# EasyEDA schematic FYP_DevBoard.json
TITLE: Sheet_1; REV: 1.0; Date: 2025-08-17; Sheet: 1/1; Drawn By: gerritcbuter; Company: Your Company
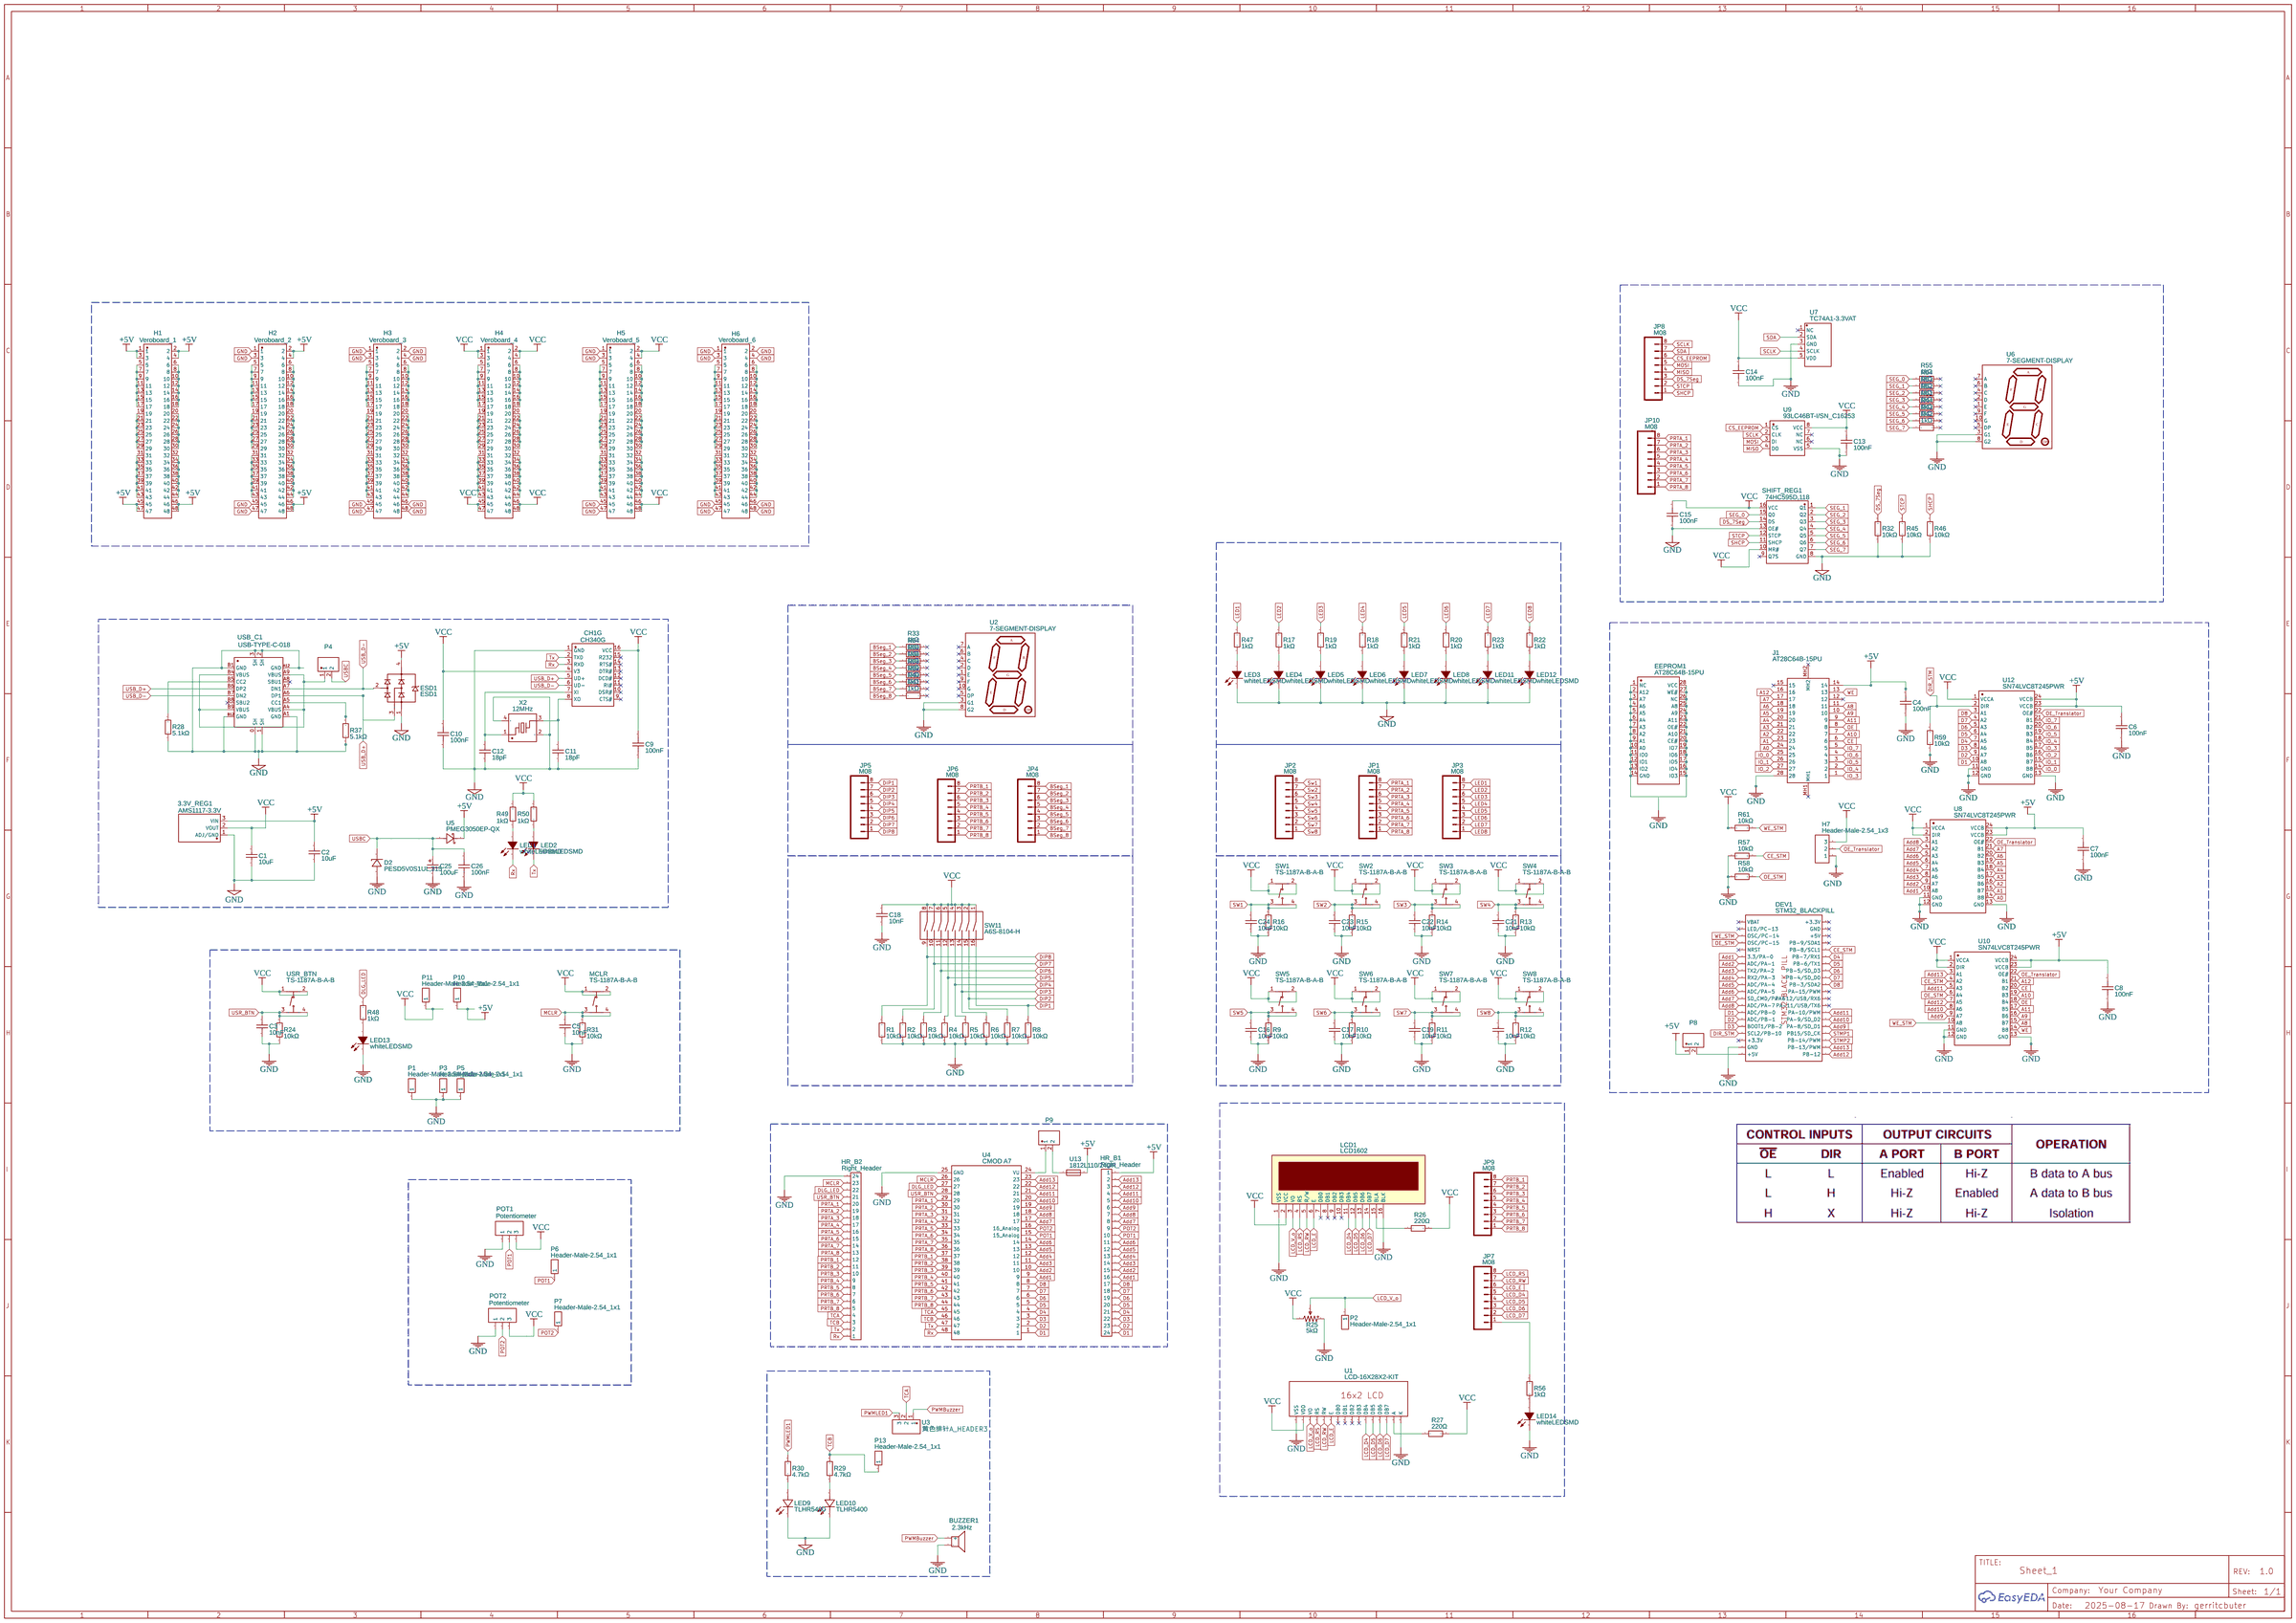
[diagram p0: schematic sheet]

## Parts
3.3V_REG1  AMS1117-3.3V  [SOT-89-3_L4.5-W2.5-P1.50-LS4.2-BR]
BUZZER1  2.3kHz  [BUZ-TH_BD12.0-P7.60-D0.6-FD]
C1  10uF  [C0603]
C2  10uF  [C0603]
C3  10nF  [C0603]
C4  100nF  [C0603]
C5  10nF  [C0603]
C6  100nF  [C0603]
C7  100nF  [C0603]
C8  100nF  [C0603]
C9  100nF  [C0603]
C10  100nF  [C0603]
C11  18pF  [C0603]
C12  18pF  [C0603]
C13  100nF  [C0603]
C14  100nF  [C0603]
C15  100nF  [C0603]
C16  10nF  [C0603]
C17  10nF  [C0603]
C18  10nF  [C0603]
C19  10nF  [C0603]
C20  10nF  [C0603]
C21  10nF  [C0603]
C22  10nF  [C0603]
C23  10nF  [C0603]
C24  10nF  [C0603]
C25  100uF  [CASE-B_3528]
C26  100nF  [C0603]
CH1G  CH340G  [SOIC-16_L9.9-W3.9-P1.27-LS6.0-BL]
D2  PESD5V0S1UL,315  [SOD-882_L1.0-W0.6-RD]
DEV1  STM32_BLACKPILL  [STM32_BLACKPILL]
EEPROM1  AT28C64B-15PU  [DIP-28_L37.0-W13.8-P2.54-LS15.8-BL]
ESD1  ESD1  [SOT-143_L2.9-W1.3-P1.92-LS2.3-BR]
H1  Veroboard_1  [VEROBOARD_HEADER]
H2  Veroboard_2  [VEROBOARD_HEADER]
H3  Veroboard_3  [VEROBOARD_HEADER]
H4  Veroboard_4  [VEROBOARD_HEADER]
H5  Veroboard_5  [VEROBOARD_HEADER]
H6  Veroboard_6  [VEROBOARD_HEADER]
H7  Header-Male-2.54_1x3  [HDR-TH_3P-P2.54-V-M-1]
HR_B1  Right_Header  [HEADER_FEMALE_2.54_1X24]
HR_B2  Right_Header  [HEADER_FEMALE_2.54_1X24]
J1  AT28C64B-15PU  [28655410]
JP1  M08  [1X08_NO_SILK]
JP2  M08  [1X08_NO_SILK]
JP3  M08  [1X08_NO_SILK]
JP4  M08  [1X08_NO_SILK]
JP5  M08  [1X08_NO_SILK]
JP6  M08  [1X08_NO_SILK]
JP7  M08  [1X08_NO_SILK]
JP8  M08  [1X08_NO_SILK]
JP9  M08  [1X08_NO_SILK]
JP10  M08  [1X08_NO_SILK]
LCD1  LCD1602  [LCD1602]
LED1  whiteLEDSMD  [LED0805-R-RD]
LED2  whiteLEDSMD  [LED0805-R-RD]
LED3  whiteLEDSMD  [LED0805-R-RD]
LED4  whiteLEDSMD  [LED0805-R-RD]
LED5  whiteLEDSMD  [LED0805-R-RD]
LED6  whiteLEDSMD  [LED0805-R-RD]
LED7  whiteLEDSMD  [LED0805-R-RD]
LED8  whiteLEDSMD  [LED0805-R-RD]
LED9  TLHR5400  [LED-TH_BD5.8-P2.54-RD]
LED10  TLHR5400  [LED-TH_BD5.8-P2.54-RD]
LED11  whiteLEDSMD  [LED0805-R-RD]
LED12  whiteLEDSMD  [LED0805-R-RD]
LED13  whiteLEDSMD  [LED0805-R-RD]
LED14  whiteLEDSMD  [LED0805-R-RD]
MCLR  TS-1187A-B-A-B  [SW-SMD_4P-L5.1-W5.1-P3.70-LS6.5-TL_H1.5]
P1  Header-Male-2.54_1x1  [HDR-TH_1P-P2.54-V-M]
P2  Header-Male-2.54_1x1  [HDR-TH_1P-P2.54-V-M]
P3  Header-Male-2.54_1x1  [HDR-TH_1P-P2.54-V-M]
P4  Female header1*2P  [HDR-TH_2P-P2.00-V-F-1]
P5  Header-Male-2.54_1x1  [HDR-TH_1P-P2.54-V-M]
P6  Header-Male-2.54_1x1  [HDR-TH_1P-P2.54-V-M]
P7  Header-Male-2.54_1x1  [HDR-TH_1P-P2.54-V-M]
P8  Female header1*2P  [HDR-TH_2P-P2.00-V-F-1]
P9  Female header1*2P  [HDR-TH_2P-P2.00-V-F-1]
P10  Header-Male-2.54_1x1  [HDR-TH_1P-P2.54-V-M]
P11  Header-Male-2.54_1x1  [HDR-TH_1P-P2.54-V-M]
P13  Header-Male-2.54_1x1  [HDR-TH_1P-P2.54-V-M]
POT1  Potentiometer  [SW-TH_PTV09A-4015F-B502]
POT2  Potentiometer  [SW-TH_PTV09A-4015F-B502]
R1  10kΩ  [R0603]
R2  10kΩ  [R0603]
R3  10kΩ  [R0603]
R4  10kΩ  [R0603]
R5  10kΩ  [R0603]
R6  10kΩ  [R0603]
R7  10kΩ  [R0603]
R8  10kΩ  [R0603]
R9  10kΩ  [R0603]
R10  10kΩ  [R0603]
R11  10kΩ  [R0603]
R12  10kΩ  [R0603]
R13  10kΩ  [R0603]
R14  10kΩ  [R0603]
R15  10kΩ  [R0603]
R16  10kΩ  [R0603]
R17  1kΩ  [R0402]
R18  1kΩ  [R0402]
R19  1kΩ  [R0402]
R20  1kΩ  [R0402]
R21  1kΩ  [R0402]
R22  1kΩ  [R0402]
R23  1kΩ  [R0402]
R24  10kΩ  [R0603]
R25  5kΩ  [RES-ADJ-TH_L9.5-W4.8-P2.54_3296Y]
R26  220Ω  [R0603]
R27  220Ω  [R0603]
R28  5.1kΩ  [R0603]
R29  4.7kΩ  [R0402]
R30  4.7kΩ  [R0402]
R31  10kΩ  [R0603]
R32  10kΩ  [R0603]
R33  1kΩ  [R0603]
R34  1kΩ  [R0603]
R35  1kΩ  [R0603]
R36  1kΩ  [R0603]
R37  5.1kΩ  [R0603]
R38  1kΩ  [R0603]
R39  1kΩ  [R0603]
R40  1kΩ  [R0603]
R41  1kΩ  [R0603]
R42  1kΩ  [R0603]
R43  1kΩ  [R0603]
R44  1kΩ  [R0603]
R45  10kΩ  [R0603]
R46  10kΩ  [R0603]
R47  1kΩ  [R0402]
R48  1kΩ  [R0603]
R49  1kΩ  [R0603]
R50  1kΩ  [R0603]
R51  1kΩ  [R0603]
R52  1kΩ  [R0603]
R53  1kΩ  [R0603]
R54  1kΩ  [R0603]
R55  1kΩ  [R0603]
R56  1kΩ  [R0603]
R57  10kΩ  [R0603]
R58  10kΩ  [R0603]
R59  10kΩ  [R0603]
R61  10kΩ  [R0603]
SHIFT_REG1  74HC595D,118  [SOIC-16_L9.9-W3.9-P1.27-LS6.0-BL]
SW1  TS-1187A-B-A-B  [SW-SMD_4P-L5.1-W5.1-P3.70-LS6.5-TL_H1.5]
SW2  TS-1187A-B-A-B  [SW-SMD_4P-L5.1-W5.1-P3.70-LS6.5-TL_H1.5]
SW3  TS-1187A-B-A-B  [SW-SMD_4P-L5.1-W5.1-P3.70-LS6.5-TL_H1.5]
SW4  TS-1187A-B-A-B  [SW-SMD_4P-L5.1-W5.1-P3.70-LS6.5-TL_H1.5]
SW5  TS-1187A-B-A-B  [SW-SMD_4P-L5.1-W5.1-P3.70-LS6.5-TL_H1.5]
SW6  TS-1187A-B-A-B  [SW-SMD_4P-L5.1-W5.1-P3.70-LS6.5-TL_H1.5]
SW7  TS-1187A-B-A-B  [SW-SMD_4P-L5.1-W5.1-P3.70-LS6.5-TL_H1.5]
SW8  TS-1187A-B-A-B  [SW-SMD_4P-L5.1-W5.1-P3.70-LS6.5-TL_H1.5]
SW11  A6S-8104-H  [SW-SMD_16P-L21.3-W6.2-P2.54-LS9.8]
U1  LCD-16X28X2-KIT  [LCD-8X2-KIT]
U2  7-SEGMENT-DISPLAY  [7-SEGMENT-DISPLAY]
U3  黄色排针A_HEADER3  [HDR-TH_3P-P2.54-V-M-1]
U4  CMOD A7  [DIGILENT CMOD A7-35T]
U5  PMEG3050EP-QX  [SOD-128_L3.7-W2.5-LS4.7-RD]
U6  7-SEGMENT-DISPLAY  [7-SEGMENT-DISPLAY]
U7  TC74A1-3.3VAT  [TO-220-5L_L10.2-W4.5-P1.71-L]
U8  SN74LVC8T245PWR  [TSSOP-24_L7.8-W4.4-P0.65-LS6.4-BL]
U9  93LC46BT-I/SN_C16253  [SOIC-8_L4.9-W3.9-P1.27-LS6.0-BL]
U10  SN74LVC8T245PWR  [TSSOP-24_L7.8-W4.4-P0.65-LS6.4-BL]
U12  SN74LVC8T245PWR  [TSSOP-24_L7.8-W4.4-P0.65-LS6.4-BL]
U13  1812L110/24DR  [R1812]
USB_C1  USB-TYPE-C-018  [USB-C_SMD-TYPE-C-31-M-12]
USR_BTN  TS-1187A-B-A-B  [SW-SMD_4P-L5.1-W5.1-P3.70-LS6.5-TL_H1.5]
X2  12MHz  [CRYSTAL-SMD_4P-L3.2-W2.5-BL]

## Library data of the parts
3.3V_REG1 = AMS1117-3.3V_C5120796: Supplier: LCSC; Supplier Part: C5120796; Manufacturer: MSKSEMI(美森科); Contributor: lcsc; JLCPCB Part Class: Extended Part
BUZZER1 = TMB12A05: Supplier: LCSC; Manufacturer: 华能; Supplier Part: C96093; JLCPCB Part Class: Extended Part
C1 C2 = CL10A105KB8NNNC: Supplier: LCSC; Manufacturer: SAMSUNG(三星); Supplier Part: C15849; JLCPCB Part Class: Basic Part
C3 C5 C16-C24 = 0603B103K500NT: Supplier: LCSC; Manufacturer: FH(风华); Supplier Part: C57112; JLCPCB Part Class: Basic Part
C4 C6-C10 C13-C15 C26 = CC0603KRX7R9BB104: Supplier: LCSC; Manufacturer: YAGEO(国巨); Supplier Part: C14663; JLCPCB Part Class: Basic Part
C11 C12 = CL10C180JB8NNNC: Supplier: LCSC; Manufacturer: SAMSUNG(三星); Supplier Part: C1647; JLCPCB Part Class: Basic Part
C25 = TAJB107K006RNJ: Supplier: LCSC; Manufacturer: Kyocera AVX; Supplier Part: C16133; JLCPCB Part Class: Basic Part
CH1G = CH340G: Supplier: LCSC; Manufacturer: WCH(南京沁恒); Supplier Part: C14267; JLCPCB Part Class: Extended Part
D2 = PESD5V0S1UL,315: Contributor: LCSC; Supplier Part: C85402; Supplier: LCSC; Manufacturer: Nexperia(安世); JLCPCB Part Class: Extended Part
DEV1 = STM32_BLACKPILL: Contributor: Matty87
EEPROM1 = AT28C64B-15PU: Supplier: LCSC; Manufacturer: MICROCHIP(美国微芯); Supplier Part: C41982; JLCPCB Part Class: Extended Part
ESD1 = TPPRTR5V0U2X: Supplier: LCSC; Supplier Part: C558444; Manufacturer: TECH PUBLIC(台舟); Contributor: LCSC; JLCPCB Part Class: Extended Part
H1-H6 = X5521FV-2X24-C70D30-1000: Contributor: LCSC; Supplier: LCSC; Supplier Part: C2682211; Manufacturer: XKB Connectivity(中国星坤); JLCPCB Part Class: Extended Part
H7 = Header-Male-2.54_1x3: Supplier: LCSC; Manufacturer: BOOMELE(博穆精密); Manufacturer Part: 2.54-1*3P针; Supplier Part: C49257; JLCPCB Part Class: Extended Part
HR_B1 HR_B2 = Header_Female_2.54_1x24: Contributor: benjaminbiles01
J1 = 28-6554-10: Contributor: Noah Tomkins (McNoahTomkins)
JP1-JP10 = M08: Contributor: SparkFun
LCD1 = LCD1602: Manufacturer: LONTECH(厦门龙特); Manufacturer Part: LCM1602K-NSW-BBW; Supplier Part: C83275; Supplier: LCSC; Contributor: LCEDA_Lib
LED1-LED8 LED11-LED14 = whiteLEDSMD: Supplier: LCSC; Manufacturer: KENTO; Manufacturer Part: KT-0805W; Supplier Part: C34499; JLCPCB Part Class: Basic Part
LED9 LED10 = TLHR5400: Supplier: LCSC; Supplier Part: C3013853; Manufacturer: VISHAY(威世); Contributor: lcsc; JLCPCB Part Class: Extended Part
MCLR SW1-SW8 USR_BTN = TS-1187A-B-A-B: Contributor: LCSC; Supplier: LCSC; Supplier Part: C318884; Manufacturer: XKB Connection(中国星坤); JLCPCB Part Class: Basic Part
P1-P3 P5-P7 P10 P11 P13 = Header-Male-2.54_1x1: Supplier: LCSC; Manufacturer: BOOMELE(博穆精密); Supplier Part: C81276; JLCPCB Part Class: Extended Part
P4 P8 P9 = Female header1*2P: Supplier: LCSC; Manufacturer: BOOMELE(博穆精密); Manufacturer Part: 2.0-1*2P母; Supplier Part: C66509; JLCPCB Part Class: Extended Part
POT1 POT2 = Header-Male-2.54_1x3: JLCPCB Part Class: Extended Part; Package Display: No
R1-R16 R24 R31 R32 R45 R46 R57-R59 R61 = 0603WAF1002T5E: Supplier: LCSC; Manufacturer: UNI-ROYAL(厚声); Supplier Part: C25804; JLCPCB Part Class: Basic Part
R17-R23 R47 = 0402WGF1001TCE: Supplier: LCSC; Manufacturer: UNI-ROYAL(厚声); Supplier Part: C11702; JLCPCB Part Class: Basic Part
R25 = 3296Y-1-502LF: Contributor: lcsc; Supplier: LCSC; Supplier Part: C780116; Manufacturer: BOURNS; JLCPCB Part Class: Extended Part
R26 R27 = 0603WAF2200T5E: Supplier: LCSC; Manufacturer: UNI-ROYAL(厚声); Supplier Part: C22962; JLCPCB Part Class: Basic Part
R28 R37 = 0603WAF5101T5E: Supplier: LCSC; Manufacturer: UNI-ROYAL(厚声); Supplier Part: C23186; JLCPCB Part Class: Basic Part
R29 R30 = 0402WGF4701TCE: Supplier: LCSC; Manufacturer: UNI-ROYAL(厚声); Supplier Part: C25900; JLCPCB Part Class: Basic Part
R33-R36 R38-R44 R48-R56 = 0603WAF1001T5E: Supplier: LCSC; Manufacturer: UNI-ROYAL(厚声); Supplier Part: C21190; JLCPCB Part Class: Basic Part
SHIFT_REG1 = 74HC595D,118: Supplier: LCSC; Manufacturer: Nexperia(安世); Supplier Part: C5947; JLCPCB Part Class: Basic Part
SW11 = A6S-8104-H: Contributor: LCSC; Supplier: LCSC; Supplier Part: C231310; Manufacturer: OMRON(欧姆龙); JLCPCB Part Class: Extended Part
U1 = LCD-16X28X2-KIT: Standard text-only 16x2 parallel input LCD; Contributor: SparkFun
U2 U6 = 7-SEGMENT-DISPLAY: Contributor: SparkFun
U3 = 黄色排针A_HEADER3: Contributor: lcsc; Supplier: LCSC; Supplier Part: C9900019266; Manufacturer: null; JLCPCB Part Class: Extended Part
U4 = CMOD A7: Manufacturer: Digilent Inc.; Manufacturer Part: 410-328-35; Supplier: Digi-Key; Supplier Part: 1286-1130-ND; link: https://reference.digilentinc.com/reference/programmable-logic/cmod-a7/start; Contributor: 0johnkim
U5 = PMEG3050EP-QX: Supplier: LCSC; Supplier Part: C5311573; Manufacturer: Nexperia(安世); JLCPCB Part Class: Extended Part; Contributor: lcsc
U7 = TC74A1-3.3VAT: Contributor: lcsc; Supplier: LCSC; Supplier Part: C641444; Manufacturer: MICROCHIP(美国微芯); JLCPCB Part Class: Extended Part
U8 U10 U12 = SN74LVC8T245PWR: Supplier: LCSC; Manufacturer: TI(德州仪器); Supplier Part: C27643; JLCPCB Part Class: Extended Part
U9 = 93LC46BT-I/SN_C16253: Supplier: LCSC; Manufacturer: MICROCHIP(美国微芯); Manufacturer Part: 93LC46BT-I/SN; Supplier Part: C16253; JLCPCB Part Class: Extended Part
U13 = 1812L110/24DR: Contributor: LCSC; Supplier: LCSC; Supplier Part: C207066; Manufacturer: Littelfuse(美国力特); JLCPCB Part Class: Extended Part
USB_C1 = USB-TYPE-C-018: Supplier: LCSC; Supplier Part: C2927038; Manufacturer: DEALON(德艺隆); Contributor: LCSC; JLCPCB Part Class: Extended Part
X2 = 7B012000Q01: Contributor: LCSC; Supplier: LCSC; Supplier Part: C654951; Manufacturer: HD(浩都频率); JLCPCB Part Class: Extended Part

## Nets
+5V: 3.3V_REG1.3(VIN) C2.2 C4.2 C6.2 C7.2 C8.2 ESD1.4 H1.1 H1.2 H1.3 H1.4 H1.45 H1.46 H1.47 H1.48 H2.2 H2.4 H2.46 H2.48 HR_B1.1 J1.14 P8.1 P10.1 U5.1(K) U8.23(VCCB) U8.24(VCCB) U10.23(VCCB) U10.24(VCCB) U12.23(VCCB) U12.24(VCCB) U13.2
GND: 3.3V_REG1.1(ADJ/GND) BUZZER1.2 C1.1 C2.1 C3.1 C4.1 C5.1 C6.1 C7.1 C8.1 C9.1 C10.1 C11.1 C12.1 C13.1 C14.1 C15.1 C16.1 C17.1 C18.1 C19.1 C20.1 C21.1 C22.1 C23.1 C24.1 C25.2 C26.1 CH1G.1(GND) D2.2(A) DEV1.39(GND) ESD1.1 H2.1 H2.3 H2.45 H2.47 H3.1 H3.2 H3.3 H3.4 H3.45 H3.46 H3.47 H3.48 H5.1 H5.3 H5.45 H5.47 H6.1 H6.2 H6.3 H6.4 H6.45 H6.46 H6.47 H6.48 H7.1 HR_B2.24 J1.28 LCD1.1(VSS) LCD1.16(BLK) LED3.2(K) LED4.2(K) LED5.2(K) LED6.2(K) LED7.2(K) LED8.2(K) LED9.1(K) LED10.1(K) LED11.2(K) LED12.2(K) LED13.2(K) LED14.2(K) P1.1 P3.1 P5.1 POT1.1 POT2.1 R1.1 R2.1 R3.1 R4.1 R5.1 R6.1 R7.1 R8.1 R9.1 R10.1 R11.1 R12.1 R13.1 R14.1 R15.1 R16.1 R24.1 R25.1 R28.1 R31.1 R32.1 R37.1 R45.1 R46.1 R57.1 R58.1 R59.1 SHIFT_REG1.8(GND) SHIFT_REG1.13(OE#) U1.1(VSS) U1.16(K) U2.3(G1) U2.8(G2) U4.25(GND) U6.3(G1) U6.8(G2) U7.3(GND) U8.11(GND) U8.12(GND) U8.13(GND) U9.5(VSS) U10.11(GND) U10.12(GND) U10.13(GND) U12.11(GND) U12.12(GND) U12.13(GND) USB_C1.0(SH) USB_C1.1(SH) USB_C1.2(SH) USB_C1.3(SH) USB_C1.A1(GND) USB_C1.A12(GND) USB_C1.B1(GND) USB_C1.B12(GND) X2.2(GND) X2.4(GND)
VCC: 3.3V_REG1.2(VOUT) C1.2 C9.2 C10.2 C13.2 C14.2 C15.2 C18.2 CH1G.4(V3) CH1G.16(VCC) H4.1 H4.2 H4.3 H4.4 H4.45 H4.46 H4.47 H4.48 H5.2 H5.4 H5.46 H5.48 H7.3 LCD1.2(VCC) MCLR.1(A) MCLR.2(B) P11.1 POT1.3 POT2.3 R25.3 R26.2 R27.2 R49.2 R50.2 R61.1 SHIFT_REG1.10(MR#) SHIFT_REG1.16(VCC) SW1.1(A) SW1.2(B) SW2.1(A) SW2.2(B) SW3.1(A) SW3.2(B) SW4.1(A) SW4.2(B) SW5.1(A) SW5.2(B) SW6.1(A) SW6.2(B) SW7.1(A) SW7.2(B) SW8.1(A) SW8.2(B) SW11.1 SW11.2 SW11.3 SW11.4 SW11.5 SW11.6 SW11.7 SW11.8 U1.2(VDD) U7.5(VDD) U8.1(VCCA) U8.2(DIR) U9.8(VCC) U10.1(VCCA) U10.2(DIR) U12.1(VCCA) USR_BTN.1(A) USR_BTN.2(B)
A0: J1.24 U8.14(B8)
A1: J1.23 U8.15(B7)
A2: J1.22 U8.16(B6)
A3: J1.21 U8.17(B5)
A4: J1.20 U8.18(B4)
A5: J1.19 U8.19(B3)
A6: J1.18 U8.20(B2)
A7: J1.17 U8.21(B1)
A8: J1.11 U10.15(B7)
A9: J1.10 U10.16(B6)
A10: J1.7 U10.19(B3)
A11: J1.9 U10.17(B5)
A12: J1.16 U10.21(B1)
Add1: DEV1.26(3.3/PA-0) HR_B1.16 U4.9 U8.10(A8)
Add2: DEV1.27(ADC/PA-1) HR_B1.15 U4.10 U8.9(A7)
Add3: DEV1.28(TX2/PA-2) HR_B1.14 U4.11 U8.8(A6)
Add4: DEV1.29(RX2/PA-3) HR_B1.13 U4.12 U8.7(A5)
Add5: DEV1.30(ADC/PA-4) HR_B1.12 U4.13 U8.6(A4)
Add6: DEV1.31(ADC/PA-5) HR_B1.11 U4.14 U8.5(A3)
Add7: DEV1.32(SD_CMD/PA-6) HR_B1.8 U4.17 U8.4(A2)
Add8: DEV1.33(ADC/PA-7) HR_B1.7 U4.18 U8.3(A1)
Add9: DEV1.5(PA-8/SD_D1) HR_B1.6 U4.19 U10.9(A7)
Add10: DEV1.6(PA-9/SD_D2) HR_B1.5 U4.20 U10.8(A6)
Add11: DEV1.7(PA-10/PWM) HR_B1.4 U4.21 U10.5(A3)
Add12: DEV1.1(PB-12) HR_B1.3 U4.22 U10.7(A5)
Add13: DEV1.2(PB-13/PWM) HR_B1.2 U4.23 U10.3(A1)
BSeg_1: JP4.8 R33.1
BSeg_2: JP4.7 R34.1
BSeg_3: JP4.6 R35.1
BSeg_4: JP4.5 R36.1
BSeg_5: JP4.4 R38.1
BSeg_6: JP4.3 R39.1
BSeg_7: JP4.2 R40.1
BSeg_8: JP4.1 R41.1
CE: J1.6 U10.20(B2)
CE_STM: DEV1.16(PB-8/SCL1) R57.2 U10.4(A2)
CS_EEPROM: JP8.6 U9.1(CS)
D1: DEV1.34(ADC/PB-0) HR_B1.24 U4.1 U12.10(A8)
D2: DEV1.35(ADC/PB-1) HR_B1.23 U4.2 U12.9(A7)
D3: DEV1.36(BOOT1/PB-2) HR_B1.22 U4.3 U12.8(A6)
D4: DEV1.15(PB-7/RX1) HR_B1.21 U4.4 U12.7(A5)
D5: DEV1.14(PB-6/TX1) HR_B1.20 U4.5 U12.6(A4)
D6: DEV1.13(PB-5/SD_D3) HR_B1.19 U4.6 U12.5(A3)
D7: DEV1.12(PB-4/SD_D0) HR_B1.18 U4.7 U12.4(A2)
D8: DEV1.11(PB-3/SDA2) HR_B1.17 U4.8 U12.3(A1)
DIP1: JP5.8 R8.2 SW11.16
DIP2: JP5.7 R7.2 SW11.15
DIP3: JP5.6 R6.2 SW11.14
DIP4: JP5.5 R5.2 SW11.13
DIP5: JP5.4 R4.2 SW11.12
DIP6: JP5.3 R3.2 SW11.11
DIP7: JP5.2 R2.2 SW11.10
DIP8: JP5.1 R1.2 SW11.9
DIR_STM: DEV1.37(SCL2/PB-10) R59.2 U12.2(DIR)
DLG_LED: HR_B2.22 R48.1 U4.27
DS_7Seg: JP8.3 R32.2 SHIFT_REG1.14(DS)
IO_0: J1.25 U12.14(B8)
IO_1: J1.26 U12.15(B7)
IO_2: J1.27 U12.16(B6)
IO_3: J1.1 U12.17(B5)
IO_4: J1.2 U12.18(B4)
IO_5: J1.3 U12.19(B3)
IO_6: J1.4 U12.20(B2)
IO_7: J1.5 U12.21(B1)
LCD_D4: JP7.5 LCD1.11(DB4) U1.11(DB4)
LCD_D5: JP7.4 LCD1.12(DB5) U1.12(DB5)
LCD_D6: JP7.3 LCD1.13(DB6) U1.13(DB6)
LCD_D7: JP7.2 LCD1.14(DB7) U1.14(DB7)
LCD_E: JP7.6 LCD1.6(E) U1.6(E)
LCD_RS: JP7.8 LCD1.4(RS) U1.4(RS)
LCD_RW: JP7.7 LCD1.5(R/W) U1.5(RW)
LCD_V_o: LCD1.3(VO) P2.1 R25.2 U1.3(VO)
LED1: JP3.8 R47.2
LED2: JP3.7 R17.2
LED3: JP3.6 R19.2
LED4: JP3.5 R18.2
LED5: JP3.4 R21.2
LED6: JP3.3 R20.2
LED7: JP3.2 R23.2
LED8: JP3.1 R22.2
MCLR: C5.2 HR_B2.23 MCLR.3(C) MCLR.4(D) R31.2 U4.26
MISO: JP8.4 U9.4(DO)
MOSI: JP8.5 U9.3(DI)
OE: J1.8 U10.18(B4)
OE_STM: DEV1.24(OSC/PC-15) R58.2 U10.6(A4)
OE_Translator: H7.2 U8.22(OE#) U10.22(OE#) U12.22(OE#)
POT1: HR_B1.10 P6.1 POT1.2 U4.15(15 Analog)
POT2: HR_B1.9 P7.1 POT2.2 U4.16(16 Analog)
PRTA_1: HR_B2.20 JP1.8 JP10.8 U4.29
PRTA_2: HR_B2.19 JP1.7 JP10.7 U4.30
PRTA_3: HR_B2.18 JP1.6 JP10.6 U4.31
PRTA_4: HR_B2.17 JP1.5 JP10.5 U4.32
PRTA_5: HR_B2.16 JP1.4 JP10.4 U4.33
PRTA_6: HR_B2.15 JP1.3 JP10.3 U4.34
PRTA_7: HR_B2.14 JP1.2 JP10.2 U4.35
PRTA_8: HR_B2.13 JP1.1 JP10.1 U4.36
PRTB_1: HR_B2.12 JP6.8 JP9.8 U4.37
PRTB_2: HR_B2.11 JP6.7 JP9.7 U4.38
PRTB_3: HR_B2.10 JP6.6 JP9.6 U4.39
PRTB_4: HR_B2.9 JP6.5 JP9.5 U4.40
PRTB_5: HR_B2.8 JP6.4 JP9.4 U4.41
PRTB_6: HR_B2.7 JP6.3 JP9.3 U4.42
PRTB_7: HR_B2.6 JP6.2 JP9.2 U4.43
PRTB_8: HR_B2.5 JP6.1 JP9.1 U4.44
PWMBuzzer: BUZZER1.1(+) U3.1
PWMLED1: R30.2 U3.3
Rx: CH1G.3(RXD) HR_B2.1 LED1.2(K) U4.48
SCLK: JP8.8 U7.4(SCLK) U9.2(CLK)
SDA: JP8.7 U7.2(SDA)
SEG_0: R55.1 SHIFT_REG1.15(Q0)
SEG_1: R54.1 SHIFT_REG1.1(Q1)
SEG_2: R53.1 SHIFT_REG1.2(Q2)
SEG_3: R52.1 SHIFT_REG1.3(Q3)
SEG_4: R51.1 SHIFT_REG1.4(Q4)
SEG_5: R44.1 SHIFT_REG1.5(Q5)
SEG_6: R43.1 SHIFT_REG1.6(Q6)
SEG_7: R42.1 SHIFT_REG1.7(Q7)
SHCP: JP8.1 R46.2 SHIFT_REG1.11(SHCP)
STCP: JP8.2 R45.2 SHIFT_REG1.12(STCP)
STMP1: DEV1.4(PB15/SD_CK)
STMP2: DEV1.3(PB-14/PWM)
Sw1: JP2.8
SW1: C24.2 R16.2 SW1.3(C) SW1.4(D)
Sw2: JP2.7
SW2: C23.2 R15.2 SW2.3(C) SW2.4(D)
Sw3: JP2.6
SW3: C22.2 R14.2 SW3.3(C) SW3.4(D)
Sw4: JP2.5
SW4: C21.2 R13.2 SW4.3(C) SW4.4(D)
Sw5: JP2.4
SW5: C16.2 R9.2 SW5.3(C) SW5.4(D)
Sw6: JP2.3
SW6: C17.2 R10.2 SW6.3(C) SW6.4(D)
Sw7: JP2.2
SW7: C19.2 R11.2 SW7.3(C) SW7.4(D)
Sw8: JP2.1
SW8: C20.2 R12.2 SW8.3(C) SW8.4(D)
TCA: HR_B2.4 U3.2 U4.45
TCB: HR_B2.3 P13.1 R29.2 U4.46
Tx: CH1G.2(TXD) HR_B2.2 LED2.2(K) U4.47
USB_D+: CH1G.5(UD+) ESD1.3 USB_C1.A6(DP1) USB_C1.B6(DP2)
USB_D-: CH1G.6(UD-) ESD1.2 USB_C1.A7(DN1) USB_C1.B7(DN2)
USBC: C25.1 C26.2 D2.1(C) P4.2 U5.2(A)
USR_BTN: C3.2 HR_B2.21 R24.2 U4.28 USR_BTN.3(C) USR_BTN.4(D)
WE: J1.13 U10.14(B8)
WE_STM: DEV1.23(OSC/PC-14) R61.2 U10.10(A8)
Net-(C11-2): C11.2 CH1G.8(XO) X2.3
Net-(C12-2): C12.2 CH1G.7(XI) X2.1
Net-(DEV1-40): DEV1.40(+5V) P8.2
Net-(EEPROM1-1): EEPROM1.1(NC) EEPROM1.2(A12) EEPROM1.3(A7) EEPROM1.4(A6) EEPROM1.5(A5) EEPROM1.6(A4) EEPROM1.7(A3) EEPROM1.8(A2) EEPROM1.9(A1) EEPROM1.10(A0) EEPROM1.11(IO0) EEPROM1.12(IO1) EEPROM1.13(IO2) EEPROM1.14(GND) EEPROM1.15(IO3) EEPROM1.16(IO4) EEPROM1.17(IO5) EEPROM1.18(IO6) EEPROM1.19(IO7) EEPROM1.20(CE#) EEPROM1.21(A10) EEPROM1.22(OE#) EEPROM1.23(A11) EEPROM1.24(A9) EEPROM1.25(A8) EEPROM1.26(NC) EEPROM1.27(WE#) EEPROM1.28(VCC)
Net-(H1-5): H1.5 H1.7 H1.9 H1.11 H1.13 H1.15 H1.17
Net-(H1-6): H1.6 H1.8 H1.10 H1.12 H1.14 H1.16 H1.18
Net-(H1-19): H1.19 H1.21 H1.23 H1.25 H1.27 H1.29
Net-(H1-20): H1.20 H1.22 H1.24 H1.26 H1.28 H1.30
Net-(H1-31): H1.31 H1.33 H1.35 H1.37 H1.39 H1.41 H1.43
Net-(H1-32): H1.32 H1.34 H1.36 H1.38 H1.40 H1.42 H1.44
Net-(H2-5): H2.5 H2.7 H2.9 H2.11 H2.13 H2.15 H2.17
Net-(H2-6): H2.6 H2.8 H2.10 H2.12 H2.14 H2.16 H2.18
Net-(H2-19): H2.19 H2.21 H2.23 H2.25 H2.27 H2.29
Net-(H2-20): H2.20 H2.22 H2.24 H2.26 H2.28 H2.30
Net-(H2-31): H2.31 H2.33 H2.35 H2.37 H2.39 H2.41 H2.43
Net-(H2-32): H2.32 H2.34 H2.36 H2.38 H2.40 H2.42 H2.44
Net-(H3-5): H3.5 H3.7 H3.9 H3.11 H3.13 H3.15 H3.17
Net-(H3-6): H3.6 H3.8 H3.10 H3.12 H3.14 H3.16 H3.18
Net-(H3-19): H3.19 H3.21 H3.23 H3.25 H3.27 H3.29
Net-(H3-20): H3.20 H3.22 H3.24 H3.26 H3.28 H3.30
Net-(H3-31): H3.31 H3.33 H3.35 H3.37 H3.39 H3.41 H3.43
Net-(H3-32): H3.32 H3.34 H3.36 H3.38 H3.40 H3.42 H3.44
Net-(H4-5): H4.5 H4.7 H4.9 H4.11 H4.13 H4.15 H4.17
Net-(H4-6): H4.6 H4.8 H4.10 H4.12 H4.14 H4.16 H4.18
Net-(H4-19): H4.19 H4.21 H4.23 H4.25 H4.27 H4.29
Net-(H4-20): H4.20 H4.22 H4.24 H4.26 H4.28 H4.30
Net-(H4-31): H4.31 H4.33 H4.35 H4.37 H4.39 H4.41 H4.43
Net-(H4-32): H4.32 H4.34 H4.36 H4.38 H4.40 H4.42 H4.44
Net-(H5-5): H5.5 H5.7 H5.9 H5.11 H5.13 H5.15 H5.17
Net-(H5-6): H5.6 H5.8 H5.10 H5.12 H5.14 H5.16 H5.18
Net-(H5-19): H5.19 H5.21 H5.23 H5.25 H5.27 H5.29
Net-(H5-20): H5.20 H5.22 H5.24 H5.26 H5.28 H5.30
Net-(H5-31): H5.31 H5.33 H5.35 H5.37 H5.39 H5.41 H5.43
Net-(H5-32): H5.32 H5.34 H5.36 H5.38 H5.40 H5.42 H5.44
Net-(H6-5): H6.5 H6.7 H6.9 H6.11 H6.13 H6.15 H6.17
Net-(H6-6): H6.6 H6.8 H6.10 H6.12 H6.14 H6.16 H6.18
Net-(H6-19): H6.19 H6.21 H6.23 H6.25 H6.27 H6.29
Net-(H6-20): H6.20 H6.22 H6.24 H6.26 H6.28 H6.30
Net-(H6-31): H6.31 H6.33 H6.35 H6.37 H6.39 H6.41 H6.43
Net-(H6-32): H6.32 H6.34 H6.36 H6.38 H6.40 H6.42 H6.44
Net-(JP7-1): JP7.1 R56.1
Net-(LCD1-15): LCD1.15(BLA) R26.1
Net-(LED1-1): LED1.1(A) R49.1
Net-(LED2-1): LED2.1(A) R50.1
Net-(LED3-1): LED3.1(A) R47.1
Net-(LED4-1): LED4.1(A) R17.1
Net-(LED5-1): LED5.1(A) R19.1
Net-(LED6-1): LED6.1(A) R18.1
Net-(LED7-1): LED7.1(A) R21.1
Net-(LED8-1): LED8.1(A) R20.1
Net-(LED9-2): LED9.2(A) R30.1
Net-(LED10-2): LED10.2(A) R29.1
Net-(LED11-1): LED11.1(A) R23.1
Net-(LED12-1): LED12.1(A) R22.1
Net-(LED13-1): LED13.1(A) R48.2
Net-(LED14-1): LED14.1(A) R56.2
Net-(P4-1): P4.1 USB_C1.A4(VBUS) USB_C1.A9(VBUS) USB_C1.B4(VBUS) USB_C1.B9(VBUS)
Net-(P9-1): P9.1 U4.24(VU)
Net-(P9-2): P9.2 U13.1
Net-(R27-1): R27.1 U1.15(A)
Net-(R28-2): R28.2 USB_C1.B5(CC2)
Net-(R37-2): R37.2 USB_C1.A5(CC1)

Not connected (* = marked no-connect by the designer): CH1G 9(CTS#)* 10(DSR#)* 11(RI#)* 12(DCD#)* 13(DTR#)* 14(RTS#)* 15(R232)*; DEV1 8(PA-11/USB/TX6)* 9(PA-12/USB/RX6)* 10(PA-15/PWM)* 17(PB-9/SDA1)* 18(+5V)* 19(GND)* 20(+3.3V)* 21(VBAT)* 22(LED/PC-13)* 25(NRST)* 38(+3.3V)*; J1 12* 15* MH1* MH2*; LCD1 7(DB0)* 8(DB1)* 9(DB2)* 10(DB3)*; R33 2*; R34 2*; R35 2*; R36 2*; R38 2*; R39 2*; R40 2*; R41 2*; R42 2*; R43 2*; R44 2*; R51 2*; R52 2*; R53 2*; R54 2*; R55 2*; SHIFT_REG1 9(Q7S)*; U1 7(DB0)* 8(DB1)* 9(DB2)* 10(DB3)*; U2 1(E)* 2(D)* 4(C)* 5(DP)* 6(B)* 7(A)* 9(F)* 10(G)*; U6 1(E)* 2(D)* 4(C)* 5(DP)* 6(B)* 7(A)* 9(F)* 10(G)*; U7 1(NC)*; U9 6(NC)* 7(NC)*; USB_C1 A8(SBU1)* B8(SBU2)*
